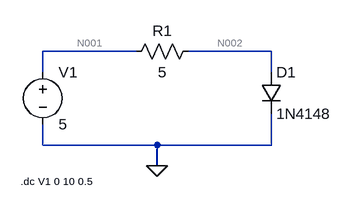
[diagram p0: schematic Draft1.asc]
Draft1.asc, the LTspice schematic file:
Version 4
SHEET 1 880 680
WIRE 144 48 0 48
WIRE 352 48 224 48
WIRE 0 80 0 48
WIRE 352 80 352 48
WIRE 0 192 0 160
WIRE 176 192 0 192
WIRE 352 192 352 144
WIRE 352 192 176 192
WIRE 176 224 176 192
FLAG 176 224 0
SYMBOL res 240 32 R90
WINDOW 0 0 56 VBottom 2
WINDOW 3 32 56 VTop 2
SYMATTR InstName R1
SYMATTR Value 5
SYMBOL diode 336 80 R0
SYMATTR InstName D1
SYMATTR Value 1N4148
SYMBOL voltage 0 64 R0
WINDOW 123 0 0 Left 0
WINDOW 39 0 0 Left 0
SYMATTR InstName V1
SYMATTR Value 5
TEXT -34 248 Left 1 !.dc V1 0 10 0.5

The netlist it stands for:
* Draft1.asc
R1 N002 N001 5
D1 N002 0 1N4148
V1 N001 0 5
.model D D
.lib standard.dio
.dc V1 0 10 0.5
.backanno
.end

* Results of the author's LTspice run, read from the files saved beside the schematic
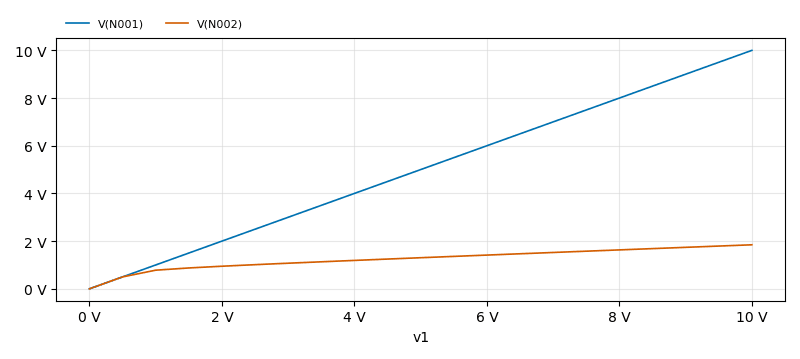
[diagram p1: DC transfer characteristic of Draft1.asc, plotted from the saved traces]
* DC transfer characteristic, 1 run:
*   V(N001): 0 V at v1=0 V, 10 V at v1=10 V, min 0 V, max 10 V
*   V(N002): 0 V at v1=0 V, 1.846 V at v1=10 V, min 0 V, max 1.846 V